# Altium schematic sheet Akhromsote.SchDoc
size A4
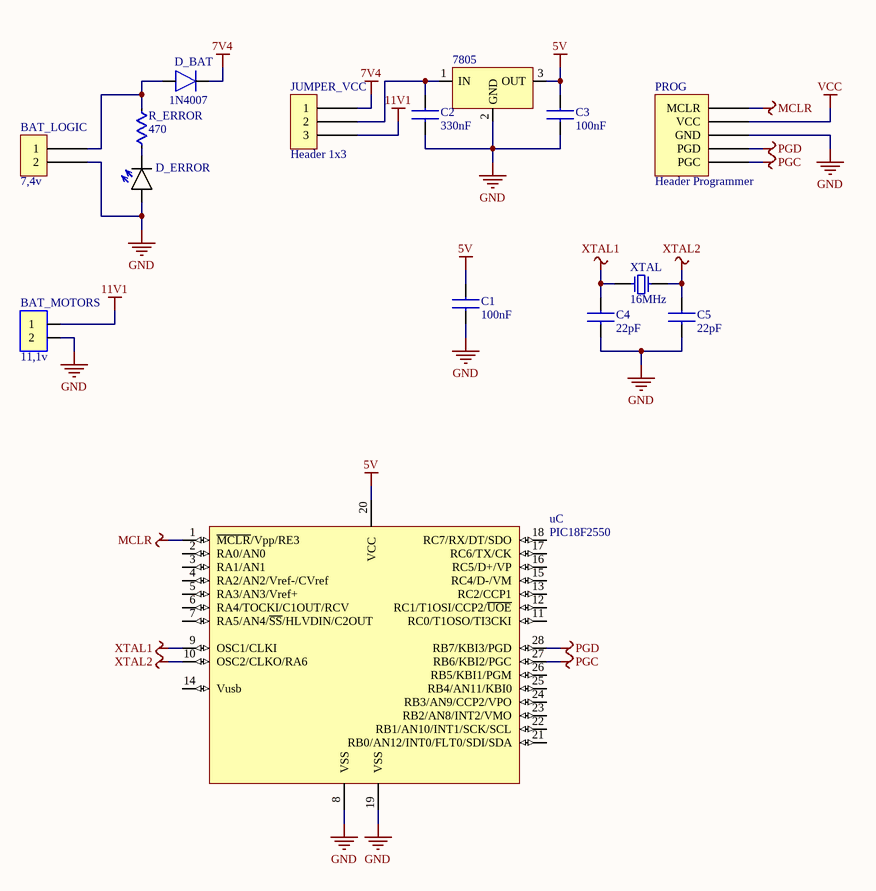
[diagram p0: Akhromsote.SchDoc]

## Parts
7805  LM78XX  [TO-220-STRAIGHT]  (value not drawn)
BAT_LOGIC  7,4v  [HEADER 1x2]
BAT_MOTORS  11,1v  [BLOCK_TERMINAL-2]
C1  value 100nF  [CAP-CER]  (hidden comment: CAP-CER)
C2  value 330nF  [CAP-CER]  (hidden comment: CAP-CER)
C3  value 100nF  [CAP-CER]  (hidden comment: CAP-CER)
C4  value 22pF  [CAP-CER]  (hidden comment: CAP-CER)
C5  value 22pF  [CAP-CER]  (hidden comment: CAP-CER)
D_BAT  NAME: 1N4007  [DO-41]  (hidden comment: DIODE)
D_ERROR  LED  [LED-3MM-RED]  (value not drawn)
JUMPER_VCC  Header 1x3  [Header 1x3]
PROG  Header Programmer  [Header 1x5]
R_ERROR  value 470  [RES-Axial-400mil]  (hidden comment: RES)
uC  PIC18F2550  [DIP28]
XTAL  FREQUENCY: 16MHz  [HC-49/S]  (hidden comment: XTAL)

## Nets
5V: 7805.3(OUT) C1.2 C3.2 uC.20(VCC)
7V4: D_BAT.K JUMPER_VCC.1
11V1: BAT_MOTORS.1 JUMPER_VCC.3
GND: 7805.2(GND) BAT_LOGIC.2 BAT_MOTORS.2 C1.1 C2.1 C3.1 C4.1 C5.1 D_ERROR.A PROG.3(GND) uC.8(VSS) uC.19(VSS)
MCLR: PROG.1(MCLR) uC.1(~{MCLR}/Vpp/RE3)
PGC: PROG.5(PGC) uC.27(RB6/KBI2/PGC)
PGD: PROG.4(PGD) uC.28(RB7/KBI3/PGD)
VCC: PROG.2(VCC)
XTAL1: C4.2 uC.9(OSC1/CLKI) XTAL.2
XTAL2: C5.2 uC.10(OSC2/CLKO/RA6) XTAL.1
Net7805_1: 7805.1(IN) C2.2 JUMPER_VCC.2
NetBAT_LOGIC_1: BAT_LOGIC.1 D_BAT.A R_ERROR.2
NetD_ERROR_K: D_ERROR.K R_ERROR.1

Not connected (* = marked no-connect by the designer): uC 2(RA0/AN0) 3(RA1/AN1) 4(RA2/AN2/Vref-/CVref) 5(RA3/AN3/Vref+) 6(RA4/TOCKI/C1OUT/RCV) 7(RA5/AN4/~{SS}/HLVDIN/C2OUT) 11(RC0/T1OSO/TI3CKI) 12(RC1/T1OSI/CCP2/~{UOE}) 13(RC2/CCP1) 14(Vusb) 15(RC4/D-/VM) 16(RC5/D+/VP) 17(RC6/TX/CK) 18(RC7/RX/DT/SDO) 21(RB0/AN12/INT0/FLT0/SDI/SDA) 22(RB1/AN10/INT1/SCK/SCL) 23(RB2/AN8/INT2/VMO) 24(RB3/AN9/CCP2/VPO) 25(RB4/AN11/KBI0) 26(RB5/KBI1/PGM)

## Library data of the parts
BAT_LOGIC = Header 1x2
BAT_MOTORS = 2-BLOCK_TERMINAL